# Altium project ArduinoUnoSheild.PrjPcb
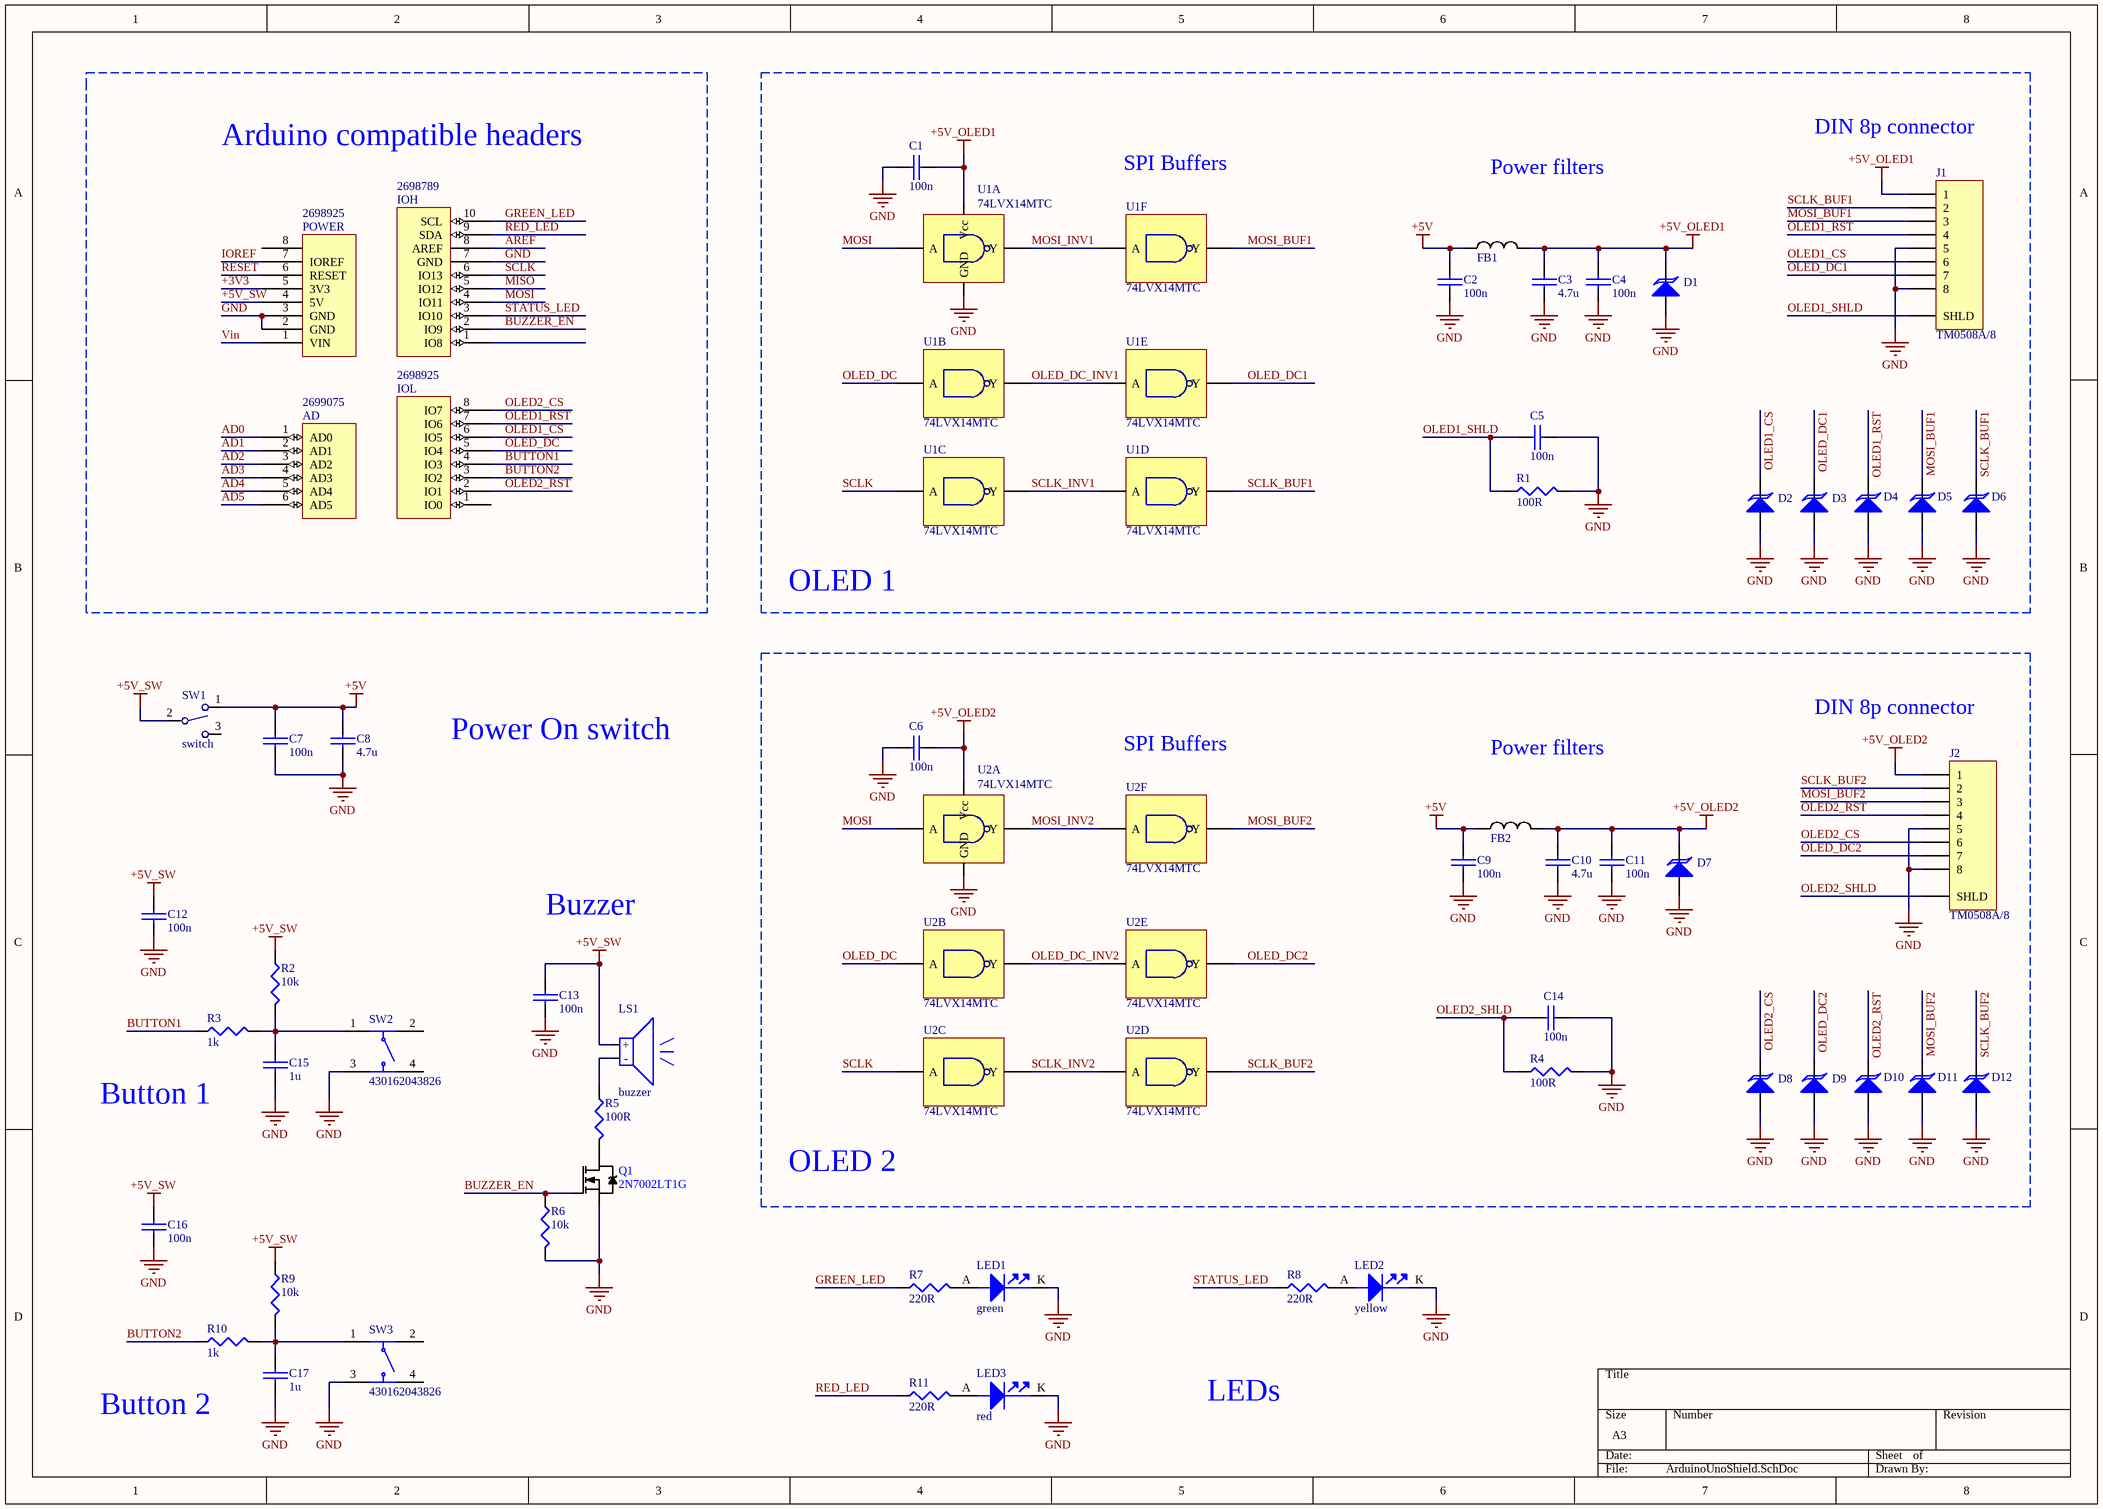
[diagram p0: ArduinoUnoShield.SchDoc]
1 sheet, 58 parts. Net scope: global (net labels, ports and power ports of the same name join across sheets).
Board file: ArduinoUnoShield.PcbDoc

## Sheet ArduinoUnoShield.SchDoc
size A3

### Parts
AD  Supplier Part Number 4: 2699075  [Header 6x1 8.5mm]  (hidden comment: AD)
C1  100n  [CAPC0402]
C2  100n  [CAPC0402]
C3  4.7u  [CAPC0603]
C4  100n  [CAPC0402]
C5  100n  [CAPC0402]
C6  100n  [CAPC0402]
C7  100n  [CAPC0402]
C8  4.7u  [CAPC0603]
C9  100n  [CAPC0402]
C10  4.7u  [CAPC0603]
C11  100n  [CAPC0402]
C12  100n  [CAPC0402]
C13  100n  [CAPC0402]
C14  100n  [CAPC0402]
C15  1u  [CAPC0603]
C16  100n  [CAPC0402]
C17  1u  [CAPC0603]
D1  ESD9L5.0ST5G  [SOD923]  (value not drawn)
D2  ESD9L5.0ST5G  [SOD923]  (value not drawn)
D3  ESD9L5.0ST5G  [SOD923]  (value not drawn)
D4  ESD9L5.0ST5G  [SOD923]  (value not drawn)
D5  ESD9L5.0ST5G  [SOD923]  (value not drawn)
D6  ESD9L5.0ST5G  [SOD923]  (value not drawn)
D7  ESD9L5.0ST5G  [SOD923]  (value not drawn)
D8  ESD9L5.0ST5G  [SOD923]  (value not drawn)
D9  ESD9L5.0ST5G  [SOD923]  (value not drawn)
D10  ESD9L5.0ST5G  [SOD923]  (value not drawn)
D11  ESD9L5.0ST5G  [SOD923]  (value not drawn)
D12  ESD9L5.0ST5G  [SOD923]  (value not drawn)
FB1  MPZ1005S121C  [RES0402]  (value not drawn)
FB2  MPZ1005S121C  [RES0402]  (value not drawn)
IOH  Supplier Part Number 3: 2698789  [Header 10x1 8.5mm]  (hidden comment: IOH)
IOL  Supplier Part Number 4: 2698925  [Header 8x1 8.5mm]  (hidden comment: IOL)
J1  TM0508A/8  [DIN SOCKET 8P THT]
J2  TM0508A/8  [DIN SOCKET 8P THT]
LED1  green  [LED-0603-GREEN]
LED2  yellow  [LED-0603-YELLOW]
LED3  red  [LED-0603-RED]
LS1  buzzer  [BUZZER DIA 9.5MM H 5MM]
POWER  Supplier Part Number 4: 2698925  [Header 8x1 8.5mm]  (hidden comment: POWER_UNO)
Q1  2N7002LT1G  [SOT23-3]
R1  100R  [RES0402]
R2  10k  [RES0402]
R3  1k  [RES0402]
R4  100R  [RES0402]
R5  100R  [RES0402]
R6  10k  [RES0402 SMALL]
R7  220R  [RES0402]
R8  220R  [RES0402]
R9  10k  [RES0402]
R10  1k  [RES0402]
R11  220R  [RES0402]
SW1  switch  [SLIDE SWITCH 5MS1S102AM6QE]
SW2  430162043826  [4301x20438x6_12*12]
SW3  430162043826  [4301x20438x6_12*12]
U1  74LVX14MTC  [TSSOP14]  (parts A,B,C,D,E,F of 6)
U2  74LVX14MTC  [TSSOP14]  (parts A,B,C,D,E,F of 6)

### Blocks framed on the sheet
Arduino compatible headers: AD IOH IOL POWER
OLED 1: C1-C5 D1-D6 FB1 J1 R1 U1
OLED 2: C6 C9-C11 C14 D7-D12 FB2 J2 R4 U2

### Nets
+5V: C2.1 C7.1 C8.1 C9.1 FB1.1 FB2.1 SW1.1
+5V_OLED1: C1.1 C3.1 C4.1 D1.K FB1.2 J1.1 U1.14(Vcc)
+5V_OLED2: C6.1 C10.1 C11.1 D7.K FB2.2 J2.1 U2.14(Vcc)
+5V_SW: C12.1 C13.1 C16.1 LS1.1(+) POWER.4(5V) R2.1 R9.1 SW1.2
GND: C1.2 C2.2 C3.2 C4.2 C5.1 C6.2 C7.2 C8.2 C9.2 C10.2 C11.2 C12.2 C13.2 C14.1 C15.2 C16.2 C17.2 D1.A D2.A D3.A D4.A D5.A D6.A D7.A D8.A D9.A D10.A D11.A D12.A IOH.7(GND) J1.5 J1.8 J2.5 J2.8 LED1.K(CATHODE) LED2.K(CATHODE) LED3.K(CATHODE) POWER.2(GND) POWER.3(GND) Q1.2(S) R1.1 R4.1 R6.2 SW2.3 SW3.3 U1.7(GND) U2.7(GND)
+3V3: POWER.5(3V3)
AD0: AD.1(AD0)
AD1: AD.2(AD1)
AD2: AD.3(AD2)
AD3: AD.4(AD3)
AD4: AD.5(AD4)
AD5: AD.6(AD5)
AREF: IOH.8(AREF)
BUTTON1: IOL.4(IO3) R3.1
BUTTON2: IOL.3(IO2) R10.1
BUZZER_EN: IOH.2(IO9) Q1.1(G) R6.1
GREEN_LED: IOH.10(SCL) R7.1
IOREF: POWER.7(IOREF)
MISO: IOH.5(IO12)
MOSI: IOH.4(IO11) U1.1(A) U2.1(A)
MOSI_BUF1: D5.K J1.3 U1.12(Y)
MOSI_BUF2: D11.K J2.3 U2.12(Y)
MOSI_INV1: U1.2(Y) U1.13(A)
MOSI_INV2: U2.2(Y) U2.13(A)
OLED1_CS: D2.K IOL.6(IO5) J1.6
OLED1_RST: D4.K IOL.7(IO6) J1.4
OLED1_SHLD: C5.2 J1.0(SHLD) R1.2
OLED2_CS: D8.K IOL.8(IO7) J2.6
OLED2_RST: D10.K IOL.2(IO1) J2.4
OLED2_SHLD: C14.2 J2.0(SHLD) R4.2
OLED_DC: IOL.5(IO4) U1.3(A) U2.3(A)
OLED_DC1: D3.K J1.7 U1.10(Y)
OLED_DC2: D9.K J2.7 U2.10(Y)
OLED_DC_INV1: U1.4(Y) U1.11(A)
OLED_DC_INV2: U2.4(Y) U2.11(A)
RED_LED: IOH.9(SDA) R11.1
RESET: POWER.6(RESET)
SCLK: IOH.6(IO13) U1.5(A) U2.5(A)
SCLK_BUF1: D6.K J1.2 U1.9(Y)
SCLK_BUF2: D12.K J2.2 U2.9(Y)
SCLK_INV1: U1.6(Y) U1.8(A)
SCLK_INV2: U2.6(Y) U2.8(A)
STATUS_LED: IOH.3(IO10) R8.1
Vin: POWER.1(VIN)
NetC15_1: C15.1 R2.2 R3.2 SW2.1
NetC17_1: C17.1 R9.2 R10.2 SW3.1
NetLED1_A: LED1.A(ANODE) R7.2
NetLED2_A: LED2.A(ANODE) R8.2
NetLED3_A: LED3.A(ANODE) R11.2
NetLS1_2: LS1.2(-) R5.1
NetQ1_3: Q1.3(D) R5.2

Not connected (* = marked no-connect by the designer): IOH 1(IO8); IOL 1(IO0); POWER 8; SW1 3; SW2 2 4; SW3 2 4

### Notes on the sheet
- SPI Buffers
- Power filters
- DIN 8p connector
- Power On switch
- Buzzer
- Button 1
- Button 2
- LEDs

### Library data of the parts
C1 C2 C4-C7 C9 C11-C14 C16 = CAP CER 0402 100n 16V X7R 10%: Capacitor: ceramic; MLCC; 100nF; 16V; X7R; ±10%; SMD; 0402; Manufacturer: Murata; Manufacturer Part Number: GRM155R71C104KA88D; Tolerance: 10%; Supplier: TME; Supplier Part Number: GRM155R71C104KA; Package: 0402; Ratings: 16V; Value: 100n
C3 C8 C10 = CAP CER 0603 4.7u 10V X5R 10%: Capacitor: ceramic; MLCC; 4.7uF; 10V; X5R; ±10%; SMD; 0603; Manufacturer: KEMET; Manufacturer Part Number: C0603C475K8PACTU; Tolerance: 10%; Supplier: TME; Supplier Part Number: C0603C475K8PAC; Package: 0603; Ratings: 10V; Value: 4.7u
C15 C17 = CAP CER 0603 1u 10V X5R 10%: Capacitor: ceramic; MLCC; 1uF; 10V; X5R; ±10%; SMD; 0603; Manufacturer: Samsung; Manufacturer Part Number: CL10A105KP8NNNC; Tolerance: 10%; Supplier: TME; Supplier Part Number: CL10B105KO8NNNC; Package: 0603; Ratings: 10V; Value: 1u
D1-D12 = TVS ESD9L5.0ST5G: Diode: transil; 150mW; 5.4V; unidirectional; SOD923; Manufacturer: ON Semi; Ratings: 5.4V; 150mW; Package: SOD923; Supplier: TME; Manufacturer Part Number: ESD9L5.0ST5G; Supplier Part Number: ESD9L5.0ST5G
FB1 FB2 = FERRITE 0402 1.2A 120R @100MHz: FERRITE BEAD 0402 1.2A 120R@100MHz; Manufacturer: TDK; DC Resistance (DCR): 90 mOhm Max; Supplier: Mouser; Supplier Part Number 1: 810-MPZ1005S121C; Current Rating: 1.2A; Manufacturer Part Number: MPZ1005S121C; Package: 0402; Value: 120R @ 100 MHz
J1 J2 = DIN MINI SOCKET 8P horizontal THT: Socket; DIN mini; female; PIN:8; shielded; THT; on PCBs; angled 90; Manufacturer: Lumberg; NoPins: 8; Manufacturer Part Number: TM0508A/8; Supplier Part Number: TM0508A/8; Supplier: TME; Category: Connectors
LED1 = LED 0603 GREEN MASS: LED; SMD; 0603; green; 3-12mcd; 1.6x0.8x0.65mm; 120°; 1.85÷2.5V; Manufacturer Part Number: KPH-1608SGD; Manufacturer: Kingbright; Ratings: 1.85-2.5V; 20mA; Supplier: TME; Supplier Part Number: KPH-1608SGD; Color: green; Category: LEDs; Package: 0603; Luminosity: 3-12mcd
LED2 = LED 0603 YELLOW MASS: LED; SMD; 0603; yellow; 3-8mcd; 1.6x0.8x0.65mm; 120°; 2.1÷2.5V; 20mA; Manufacturer Part Number: KPH-1608YD; Manufacturer: Kingbright; Ratings: 2.1-2.5V; 20mA; Supplier: TME; Supplier Part Number: KPH-1608YD; Color: yellow; Category: LEDs; Package: 0603; Luminosity: 3-8mcd
LED3 = LED 0603 RED MASS: LED; SMD; 0603; red; 5-12mcd; 1.6x0.8x0.65mm; 120°; 2÷2.5V; 20mA; Manufacturer Part Number: KPH-1608ID; Manufacturer: Kingbright; Ratings: 2-2.5V; 20mA; Supplier: TME; Supplier Part Number: KPH-1608ID; Color: red; Category: LEDs; Package: 0603; Luminosity: 5-12mcd
LS1 = BUZZER LBMT0905XH05: Elektromagnetic buzzer /w gen; Ø:9.5mm; H:5mm; 5VDC; Manufacturer: BESTAR; Supplier: TME; Rated voltage: 5VDC; Dimension: Dia: 9.5mm, H: 5mm; Supplier Part Number: BMT-0905XH0; Category: Audio Products; Manufacturer Part Number: BMT0905XH05
Q1 = N-MOSFET 2N7002LT1G: Transistor: N-MOSFET; unipolar; logic level; 60V; 115mA; 225mW; Manufacturer: ON Semiconductor; Ratings: 60V, 115mA, 225mW; Package: SOT23-3; Supplier: TME; Supplier Part Number: 2N7002LT1G; Manufacturer Part Number: 2N7002LT1G; Category: Transistors
R1 R4 = RES 0402 100R 1% 63mW: Resistor: thick film; SMD; 0402; 100R; 63mW; ±1%; -55÷155°C; Manufacturer: Vishay; Manufacturer Part Number: CRCW0402100RFKTDBC; Ratings: 1/16W; Supplier: TME; Supplier Part Number: CRCW0402100RFKTDBC; Package: 0402; Value: 100R; Tolerance: 1%
R2 R6 R9 = RES 0402 10k 1% 63mW: Resistor: thick film; SMD; 0402; 10k; 63mW; ±1%; -55÷155°C; Manufacturer: ROHM; Manufacturer Part Number: 0402WGF1002TCE; Ratings: 1/16W; Supplier: TME; Supplier Part Number: SMD0402-10K-1%; Package: 0402; Value: 10k; Tolerance: 1%
R3 R10 = RES 0402 1k 1% 63mW: Resistor: thick film; SMD; 0402; 1k; 63mW; ±1%; -55÷155°C; Manufacturer: Vishay; Manufacturer Part Number: CRCW04021K00FKTDBC; Ratings: 1/16W; Supplier: TME; Supplier Part Number: CRCW04021K00FKTDBC; Package: 0402; Value: 1k; Tolerance: 1%
R5 = RES 0402 100R 1% 63mW: Resistor: thick film; SMD; 0402; 100Ω; 63mW; ±1%; -55÷155°C; Manufacturer: Vishay; Manufacturer Part Number: CRCW0402100RFKTDBC; Ratings: 1/16W; Supplier: TME; Supplier Part Number: CRCW0402100RFKTDBC; Package: 0402; Value: 100R; Tolerance: 1%
R7 R8 R11 = RES 0402 220R 1% 63mW: Rezystor: thick film; SMD; 0402; 220R; 63mW; ±1%; -55÷155°C; Manufacturer: ROHM; Manufacturer Part Number: 0402WGF2200TCE; Ratings: 1/16W; Supplier: TME; Supplier Part Number: SMD0402-220R-1%; Package: 0402; Value: 220R; Tolerance: 1%
SW1 = SWITCH SLIDE SPDT THT: Switch: slide; Positions:2; SPDT; 2A/250VAC; 5A/28VDC; ON-ON; Manufacturer: TME?; Manufacturer Part Number: 5MS1S102AM6QE; Supplier: TME; Supplier Part Number: 5MS1S102AM6QE; Category: Switches
SW2 SW3 = TACTILE SWITCH 12x12mm 430162043826: 12x12mm Vertical type, SMD, height 4.3mm, T&R; Manufacturer: Wurth; Supplier Part Number: 430162043826; Supplier: Wurth; Category: Misc; Manufacturer Part Number: 430162043826
U1 U2 = NOT GATE 6CH 74LVX14MTC: C: digital; NOT; Channels:6; Inputs:6; SMD; TSSOP14; Series: LVX; Manfuacturer: ON Semi; Voltage: 2 - 3.6V; Supplier: TME; Manufacturer Part Number: 74LVX14MTC; Supplier Part Number: 74LVX14MTC; Category: IC - Logic; Package: TSSOP14
AD = AD: Supplier 1: Arrow; Supplier Part Number 1: 2699089; Supplier 2: Digi-Key; Supplier Part Number 2: SAM1198-06-ND; Supplier 3: Arrow; Supplier Part Number 3: 2699088; Supplier 4: Arrow
IOH = IOH: Supplier 1: Arrow; Supplier Part Number 1: 2698803S4475693N1004; Supplier 2: Digi-Key; Supplier Part Number 2: SAM1198-10-ND; Supplier 3: Arrow
IOL = IOL: Supplier 1: Digi-Key; Supplier Part Number 1: SAM1198-08-ND; Supplier 2: Arrow; Supplier Part Number 2: 2698939; Supplier 3: Arrow; Supplier Part Number 3: 2698940; Supplier 4: Arrow
POWER = POWER_UNO: Supplier 1: Digi-Key; Supplier Part Number 1: SAM1198-08-ND; Supplier 2: Arrow; Supplier Part Number 2: 2698939; Supplier 3: Arrow; Supplier Part Number 3: 2698940; Supplier 4: Arrow